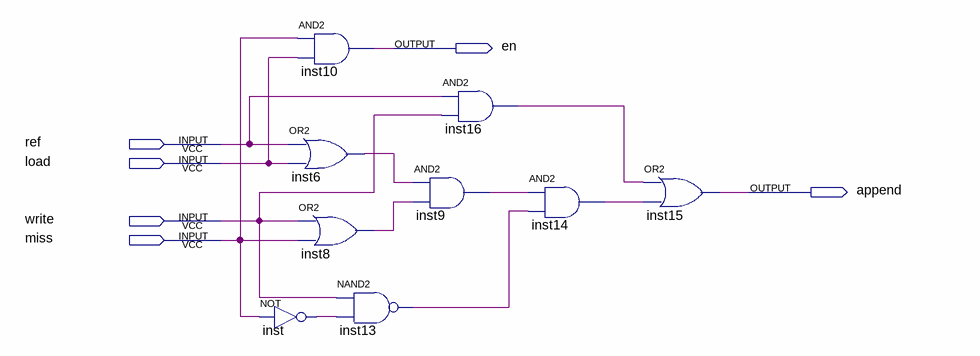
[diagram p0: schematic sheet]
// Quartus schematic contr.bdf as structural Verilog: 9 symbols, 6 pins
module contr (
  input  \ref ,
  input  load,
  input  write,
  input  miss,
  output en,
  output append
);

  wire inst6_out, inst8_out, inst9_out, inst13_out, inst14_out, inst16_out, inst_out;

  or inst6 (inst6_out, \ref , load);
  not inst (inst_out, miss);
  and inst10 (en, miss, load);
  or inst8 (inst8_out, write, miss);
  nand inst13 (inst13_out, write, inst_out);
  and inst16 (inst16_out, \ref , write);
  and inst9 (inst9_out, inst6_out, inst8_out);
  and inst14 (inst14_out, inst9_out, inst13_out);
  or inst15 (append, inst16_out, inst14_out);
endmodule
